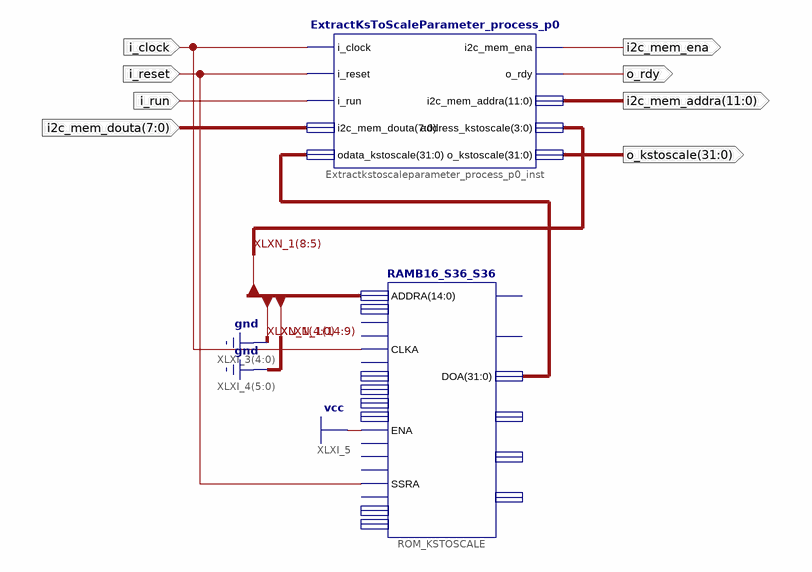
[diagram p0: schematic sheet 1]
// Xilinx ISE schematic ExtractKsToScaleParameter.sch (spartan3e) as structural Verilog: 2 symbols, 8 ports
module ExtractKsToScaleParameter (
  input  i_clock,
  input  i_reset,
  input  i_run,
  input  [7:0] i2c_mem_douta,
  output i2c_mem_ena,
  output o_rdy,
  output [11:0] i2c_mem_addra,
  output [31:0] o_kstoscale
);

  wire [8:5] XLXN_1;
  wire [31:0] XLXN_20;

  RAMB16_S36_S36 #(.INIT_00("4700000046800000460000004580000045000000448000004400000043800000"), .INIT_01("4b0000004a8000004a0000004980000049000000488000004800000047800000"), .WRITE_WIDTH_B(36), .WRITE_WIDTH_A(36), .WRITE_MODE_B("READ_FIRST"), .WRITE_MODE_A("READ_FIRST"), .READ_WIDTH_B(36), .READ_WIDTH_A(36)) ROM_KSTOSCALE (
    .ADDRA({{6{1'b0}}, XLXN_1, {5{1'b0}}}), .CLKA(i_clock), .ENA(1'b1), .SSRA(i_reset), .DOA(XLXN_20));  // open: ADDRB, CASCADEINA, CASCADEINB, CLKB, DIA, DIB, DIPA, DIPB, REGCEA, REGCEB, ENB, SSRB, WEA, WEB, CASCADEOUTA, CASCADEOUTB, DOB, DOPA, DOPB
  ExtractKsToScaleParameter_process_p0 Extractkstoscaleparameter_process_p0_inst (
    .i_clock(i_clock), .i_reset(i_reset), .i_run(i_run), .i2c_mem_douta(i2c_mem_douta),
    .odata_kstoscale(XLXN_20), .i2c_mem_ena(i2c_mem_ena), .o_rdy(o_rdy), .i2c_mem_addra(i2c_mem_addra),
    .address_kstoscale(XLXN_1), .o_kstoscale(o_kstoscale));
endmodule
